# Altium schematic sheet Mutiple_V1.SchDoc
size A4
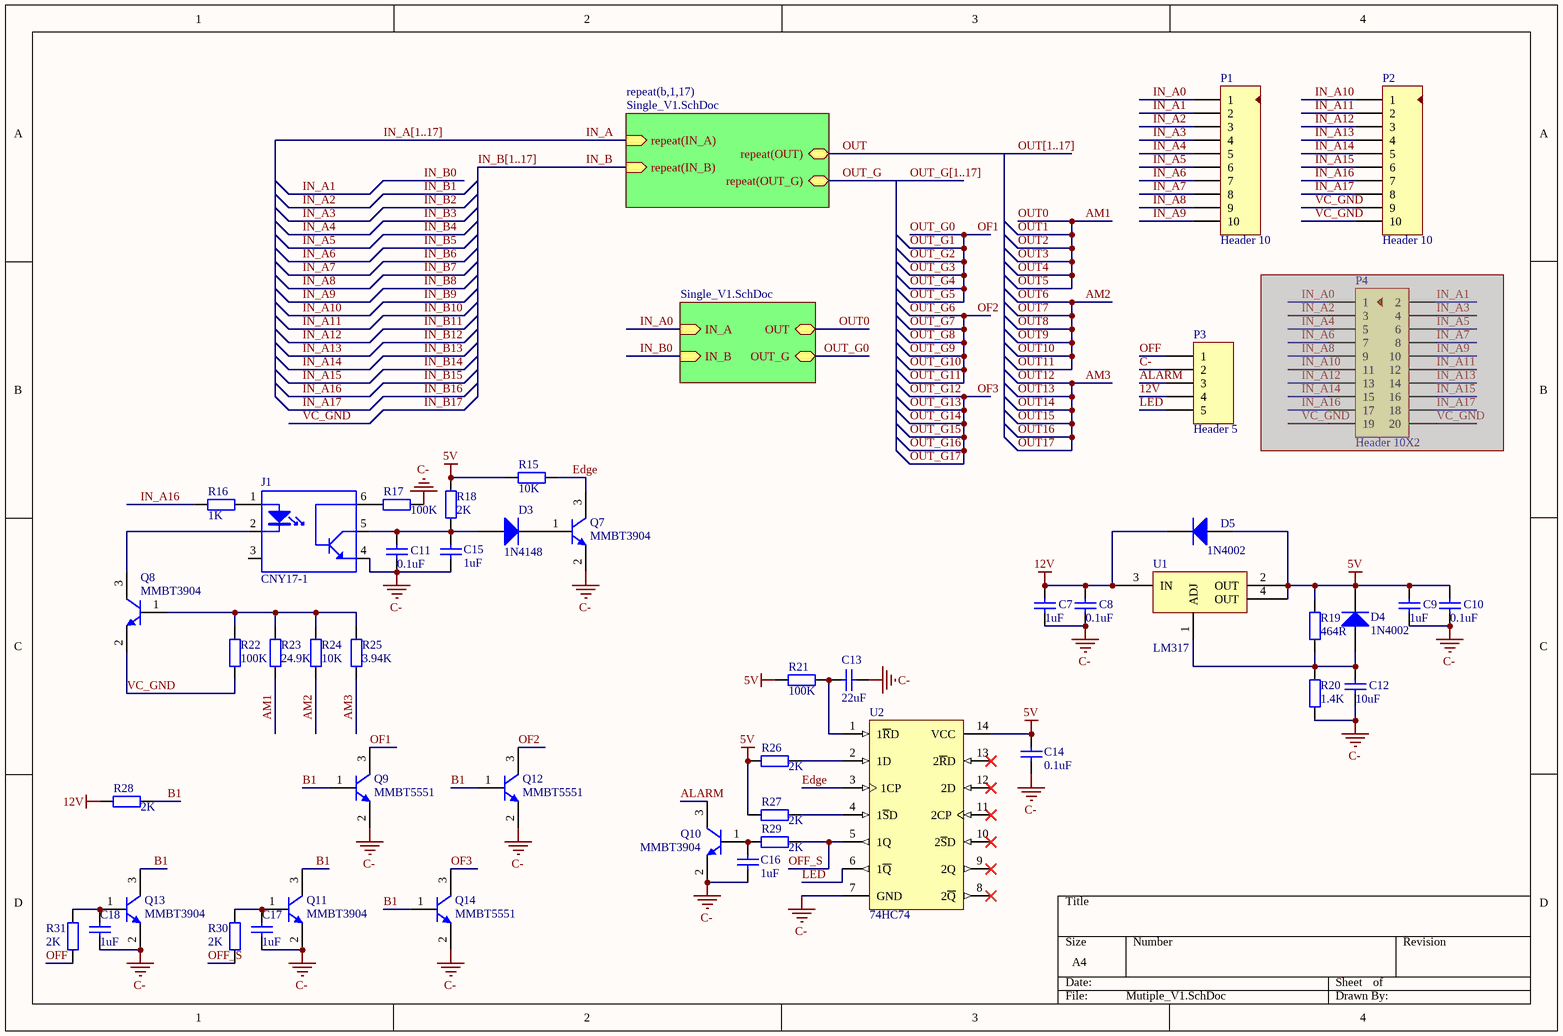
[diagram p0: Mutiple_V1.SchDoc]

## Parts
C7  value 1uF  [C-0603]  (hidden comment: Cap-S)
C8  value 0.1uF  [C-0603]  (hidden comment: Cap-S)
C9  value 1uF  [C-0603]  (hidden comment: Cap-S)
C10  value 0.1uF  [C-0603]  (hidden comment: Cap-S)
C11  value 0.1uF  [C-0603]  (hidden comment: Cap-S)
C12  value 10uF  [C-0603]  (hidden comment: Cap-S)
C13  value 22uF  [C-0603]  (hidden comment: Cap-S)
C14  value 0.1uF  [C-0603]  (hidden comment: Cap-S)
C15  value 1uF  [C-0603]  (hidden comment: Cap-S)
C16  value 1uF  [C-0603]  (hidden comment: Cap-S)
C17  value 1uF  [C-0603]  (hidden comment: Cap-S)
C18  value 1uF  [C-0603]  (hidden comment: Cap-S)
D3  1N4148  [LED-0805]
D4  1N4002  [D-SMA]
D5  1N4002  [D-SMA]
J1  CNY17-1  [DIP-6]
P1  Header 10  [HDR10X1-2.54]
P2  Header 10  [HDR10X1-2.54]
P3  Header 5  [HDR1X5]
P4  Header 10X2  [HDR10X2-2.54]  (masked out: inside a compile mask, not in the netlist)
Q7  MMBT3904  [SOT23-3]
Q8  MMBT3904  [SOT23-3]
Q9  MMBT5551  [SOT23-3]
Q10  MMBT3904  [SOT23-3]
Q11  MMBT3904  [SOT23-3]
Q12  MMBT5551  [SOT23-3]
Q13  MMBT3904  [SOT23-3]
Q14  MMBT5551  [SOT23-3]
R15  value 10K  [0603-1]  (hidden comment: Res1)
R16  value 1K  [0603-1]  (hidden comment: Res1)
R17  value 100K  [0603-1]  (hidden comment: Res1)
R18  value 2K  [0603-1]  (hidden comment: Res1)
R19  value 464R  [0603-1]  (hidden comment: Res1)
R20  value 1.4K  [0603-1]  (hidden comment: Res1)
R21  value 100K  [0603-1]  (hidden comment: Res1)
R22  value 100K  [0603-1]  (hidden comment: Res1)
R23  value 24.9K  [0603-1]  (hidden comment: Res1)
R24  value 10K  [0603-1]  (hidden comment: Res1)
R25  value 3.94K  [0603-1]  (hidden comment: Res1)
R26  value 2K  [0603-1]  (hidden comment: Res1)
R27  value 2K  [0603-1]  (hidden comment: Res1)
R28  value 2K  [0603-1]  (hidden comment: Res1)
R29  value 2K  [0603-1]  (hidden comment: Res1)
R30  value 2K  [0603-1]  (hidden comment: Res1)
R31  value 2K  [0603-1]  (hidden comment: Res1)
U1  LM317  [SOT223]
U2  74HC74  [SOIC-14]

## Sub-sheets
repeat(b,1,17) = Single_V1.SchDoc: repeat(IN_A) (in), repeat(IN_B) (in), repeat(OUT) (bidir), repeat(OUT_G) (bidir)
? = Single_V1.SchDoc: IN_A (in), IN_B (in), OUT (bidir), OUT_G (bidir)

## Nets
5V: C9.2 C10.2 C14.1 D4.2(K) D5.1(A) R15.2 R18.2 R19.1 R21.2 R26.2 R27.2 U1.2(OUT) U1.4(OUT) U2.14(VCC)
12V: C7.2 C8.2 D5.2(K) P3.4 R28.1 U1.3(IN)
C-: C7.1 C8.1 C9.1 C10.1 C11.1 C12.1 C13.1 C14.2 C15.2 C16.2 C17.2 C18.2 J1.4(E) P3.2 Q7.2(E) Q9.2(E) Q10.2(E) Q11.2(E) Q12.2(E) Q13.2(E) Q14.2(E) R17.2 R20.2 U2.7(GND)
ALARM: P3.3 Q10.3(C)
AM1: R23.1 ; sheet /OUT  [also labelled OUT0, OUT1, OUT2, OUT3, OUT4, OUT5]
AM2: R24.1  [also labelled OUT10, OUT11, OUT6, OUT7, OUT8, OUT9]
AM3: R25.1  [also labelled OUT12, OUT13, OUT14, OUT15, OUT16, OUT17]
B1: Q9.1(B) Q11.3(C) Q12.1(B) Q13.3(C) Q14.1(B) R28.2
Edge: Q7.3(C) R15.1 U2.3(1CP)
IN_A: sheet repeat(b,1,17)/repeat(IN_A)
IN_A0: P1.1 ; sheet /IN_A
IN_A1: P1.2 ; sheet /IN_B  [also labelled IN_B0]
IN_A2: P1.3  [also labelled IN_B1]
IN_A3: P1.4  [also labelled IN_B2]
IN_A4: P1.5  [also labelled IN_B3]
IN_A5: P1.6  [also labelled IN_B4]
IN_A6: P1.7  [also labelled IN_B5]
IN_A7: P1.8  [also labelled IN_B6]
IN_A8: P1.9  [also labelled IN_B7]
IN_A9: P1.10  [also labelled IN_B8]
IN_A10: P2.1  [also labelled IN_B9]
IN_A11: P2.2  [also labelled IN_B10]
IN_A12: P2.3  [also labelled IN_B11]
IN_A13: P2.4  [also labelled IN_B12]
IN_A14: P2.5  [also labelled IN_B13]
IN_A15: P2.6  [also labelled IN_B14]
IN_A16: P2.7 R16.1  [also labelled IN_B15]
IN_A17: P2.8  [also labelled IN_B16]
IN_B: sheet repeat(b,1,17)/repeat(IN_B)
IN_B17: P2.9 P2.10 Q8.2(E) R22.1  [also labelled VC_GND]
LED: P3.5 U2.6(1~{Q})
OF1: Q9.3(C) ; sheet /OUT_G  [also labelled OUT_G0, OUT_G1, OUT_G2, OUT_G3, OUT_G4, OUT_G5]
OF2: Q12.3(C)  [also labelled OUT_G10, OUT_G11, OUT_G6, OUT_G7, OUT_G8, OUT_G9]
OF3: Q14.3(C)  [also labelled OUT_G12, OUT_G13, OUT_G14, OUT_G15, OUT_G16, OUT_G17]
OFF: P3.1 R31.1
OFF_S: R29.1 R30.1 U2.5(1Q)
OUT: sheet repeat(b,1,17)/repeat(OUT)
OUT_G: sheet repeat(b,1,17)/repeat(OUT_G)
NetC11_2: C11.2 C15.1 D3.1(A) J1.5(C) R18.1
NetC12_2: C12.2 D4.1(A) R19.2 R20.1 U1.1(ADJ)
NetC13_2: C13.2 R21.1 U2.1(1~{R}D)
NetC16_1: C16.1 Q10.1(B) R29.2
NetC17_1: C17.1 Q11.1(B) R30.2
NetC18_1: C18.1 Q13.1(B) R31.2
NetD3_2: D3.2(K) Q7.1(B)
NetJ1_1: J1.1(A) R16.2
NetJ1_2: J1.2(K) Q8.3(C)
NetJ1_6: J1.6(B) R17.1
NetQ8_1: Q8.1(B) R22.2 R23.2 R24.2 R25.2
NetR26_1: R26.1 U2.2(1D)
NetR27_1: R27.1 U2.4(1~{S}D)

Not connected (* = marked no-connect by the designer): J1 3(NC); U2 8(2~{Q})* 9(2Q)* 10(2~{S}D)* 11(2CP)* 12(2D)* 13(2~{R}D)*

## Buses and harness runs
bus IN_A[1..17]
bus IN_B[1..17]
bus OUT[1..17]
bus OUT_G[1..17]

## Library data of the parts
C7-C18 = Cap-S: 贴片瓷片电容; Published: 8-Jun-2000; LatestRevisionDate: 17-Jul-2002; LatestRevisionNote: Re-released for DXP Platform.; PackageReference: RAD-0.3; Publisher: Altium Limited
D3-D5 = Diode-R: 整流二极管; Published: 8-Jun-2000; LatestRevisionDate: 17-Jul-2002; LatestRevisionNote: Re-released for DXP Platform.; PackageDocument: Sep-1996; PackageReference: SMC; Publisher: Altium Limited
J1 = CNY17-1: 光电耦合器
P1 P2 = Header 10: 接插件; LatestRevisionDate: 17-Jul-2002; LatestRevisionNote: Re-released for DXP Platform.; Publisher: Altium Limited
P3 = Header 5: Header, 5-Pin; LatestRevisionDate: 17-Jul-2002; LatestRevisionNote: Re-released for DXP Platform.; Publisher: Altium Limited
P4 = Header 10X2: 接插件; LatestRevisionDate: 17-Jul-2002; LatestRevisionNote: Re-released for DXP Platform.; Publisher: Altium Limited
Q7-Q14 = NPN1: 贴片三极管; Published: 8-Jun-2000; LatestRevisionDate: 15-Jan-2003; LatestRevisionNote: PCB Footprint 'BCY-W3/D4.7' replaced; DatasheetDocument: 1997; PackageDocument: Sep-1998; PackageReference: TO-92A; Publisher: Altium Limited; Code_JEDEC: TO-92A; ComponentLink1Description: Manufacturer Link; ComponentLink1URL: http://www.fairchildsemi.com/; ComponentLink2Description: Datasheet; ComponentLink2URL: http://www.fairchildsemi.com/ds/2N%2F2N3904.pdf
R15-R31 = Res1: 贴片电阻; Published: 8-Jun-2000; LatestRevisionDate: 17-Jul-2002; LatestRevisionNote: Re-released for DXP Platform.; PackageReference: AXIAL-0.4; Publisher: Altium Limited
U1 = LM317: 稳压芯片
U2 = 74HC74: 单输入端双D触发器; Published: 17-Jul-2002; LatestRevisionDate: 13-Apr-2006; LatestRevisionNote: IPC-7351 Footprint Added.; DatasheetVersion: Nov-1999; PackageVersion: 2000; PackageReference: M16D; Publisher: Altium Limited; PackageDescription: 16-Pin Small Outline Package 1.27 mm Pitch; ComponentLink1Description: Manufacturer Link; ComponentLink1URL: http://www.fairchildsemi.com/; ComponentLink2Description: Datasheet; ComponentLink2URL: http://www.fairchildsemi.com/ds/74%2F74AC138.pdf